# Altium schematic sheet Offboard Kinen Expansion.SchDoc
size A
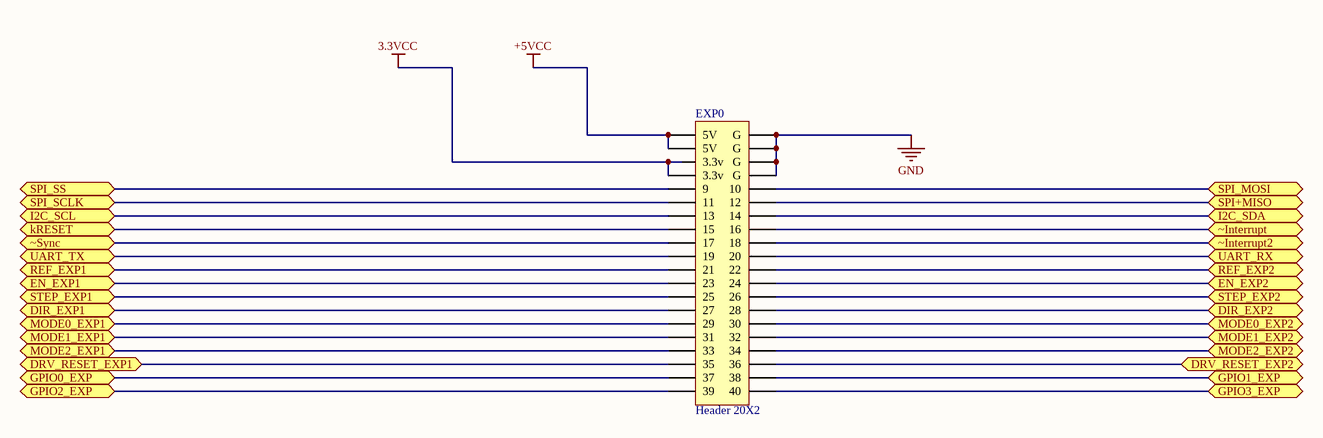
[diagram p0: Offboard Kinen Expansion.SchDoc]

## Parts
EXP0  Header 20X2  [HDR2X20]

## Ports
DIR_EXP1, DIR_EXP2, DRV_RESET_EXP1, DRV_RESET_EXP2, EN_EXP1, EN_EXP2, GPIO0_EXP, GPIO1_EXP, GPIO2_EXP, GPIO3_EXP, I2C_SCL, I2C_SDA, kRESET, MODE0_EXP1, MODE0_EXP2, MODE1_EXP1, MODE1_EXP2, MODE2_EXP1, MODE2_EXP2, REF_EXP1, REF_EXP2, SPI+MISO, SPI_MOSI, SPI_SCLK, SPI_SS, STEP_EXP1, STEP_EXP2, UART_RX, UART_TX, ~Interrupt, ~Interrupt2, ~Sync

## Nets
3.3VCC: EXP0.5(3.3v) EXP0.7(3.3v)
+5VCC: EXP0.1(5V) EXP0.3(5V)
GND: EXP0.2(G) EXP0.4(G) EXP0.6(G) EXP0.8(G)
DIR_EXP1: EXP0.27 ; port DIR_EXP1
DIR_EXP2: EXP0.28 ; port DIR_EXP2
DRV_RESET_EXP1: EXP0.35 ; port DRV_RESET_EXP1
DRV_RESET_EXP2: EXP0.36 ; port DRV_RESET_EXP2
EN_EXP1: EXP0.23 ; port EN_EXP1
EN_EXP2: EXP0.24 ; port EN_EXP2
GPIO0_EXP: EXP0.37 ; port GPIO0_EXP
GPIO1_EXP: EXP0.38 ; port GPIO1_EXP
GPIO2_EXP: EXP0.39 ; port GPIO2_EXP
GPIO3_EXP: EXP0.40 ; port GPIO3_EXP
I2C_SCL: EXP0.13 ; port I2C_SCL
I2C_SDA: EXP0.14 ; port I2C_SDA
kRESET: EXP0.15 ; port kRESET
MODE0_EXP1: EXP0.29 ; port MODE0_EXP1
MODE0_EXP2: EXP0.30 ; port MODE0_EXP2
MODE1_EXP1: EXP0.31 ; port MODE1_EXP1
MODE1_EXP2: EXP0.32 ; port MODE1_EXP2
MODE2_EXP1: EXP0.33 ; port MODE2_EXP1
MODE2_EXP2: EXP0.34 ; port MODE2_EXP2
REF_EXP1: EXP0.21 ; port REF_EXP1
REF_EXP2: EXP0.22 ; port REF_EXP2
SPI+MISO: EXP0.12 ; port SPI+MISO
SPI_MOSI: EXP0.10 ; port SPI_MOSI
SPI_SCLK: EXP0.11 ; port SPI_SCLK
SPI_SS: EXP0.9 ; port SPI_SS
STEP_EXP1: EXP0.25 ; port STEP_EXP1
STEP_EXP2: EXP0.26 ; port STEP_EXP2
UART_RX: EXP0.20 ; port UART_RX
UART_TX: EXP0.19 ; port UART_TX
~Interrupt: EXP0.16 ; port ~Interrupt
~Interrupt2: EXP0.18 ; port ~Interrupt2
~Sync: EXP0.17 ; port ~Sync

## Library data of the parts
EXP0 = Header 20X2: Header, 20-Pin, Dual row; LatestRevisionDate: 17-Jul-2002; LatestRevisionNote: Re-released for DXP Platform.; Publisher: Altium Limited